# Altium schematic sheet 40.Flash-eMMC Flash.SchDoc
size 297 x 209 mm
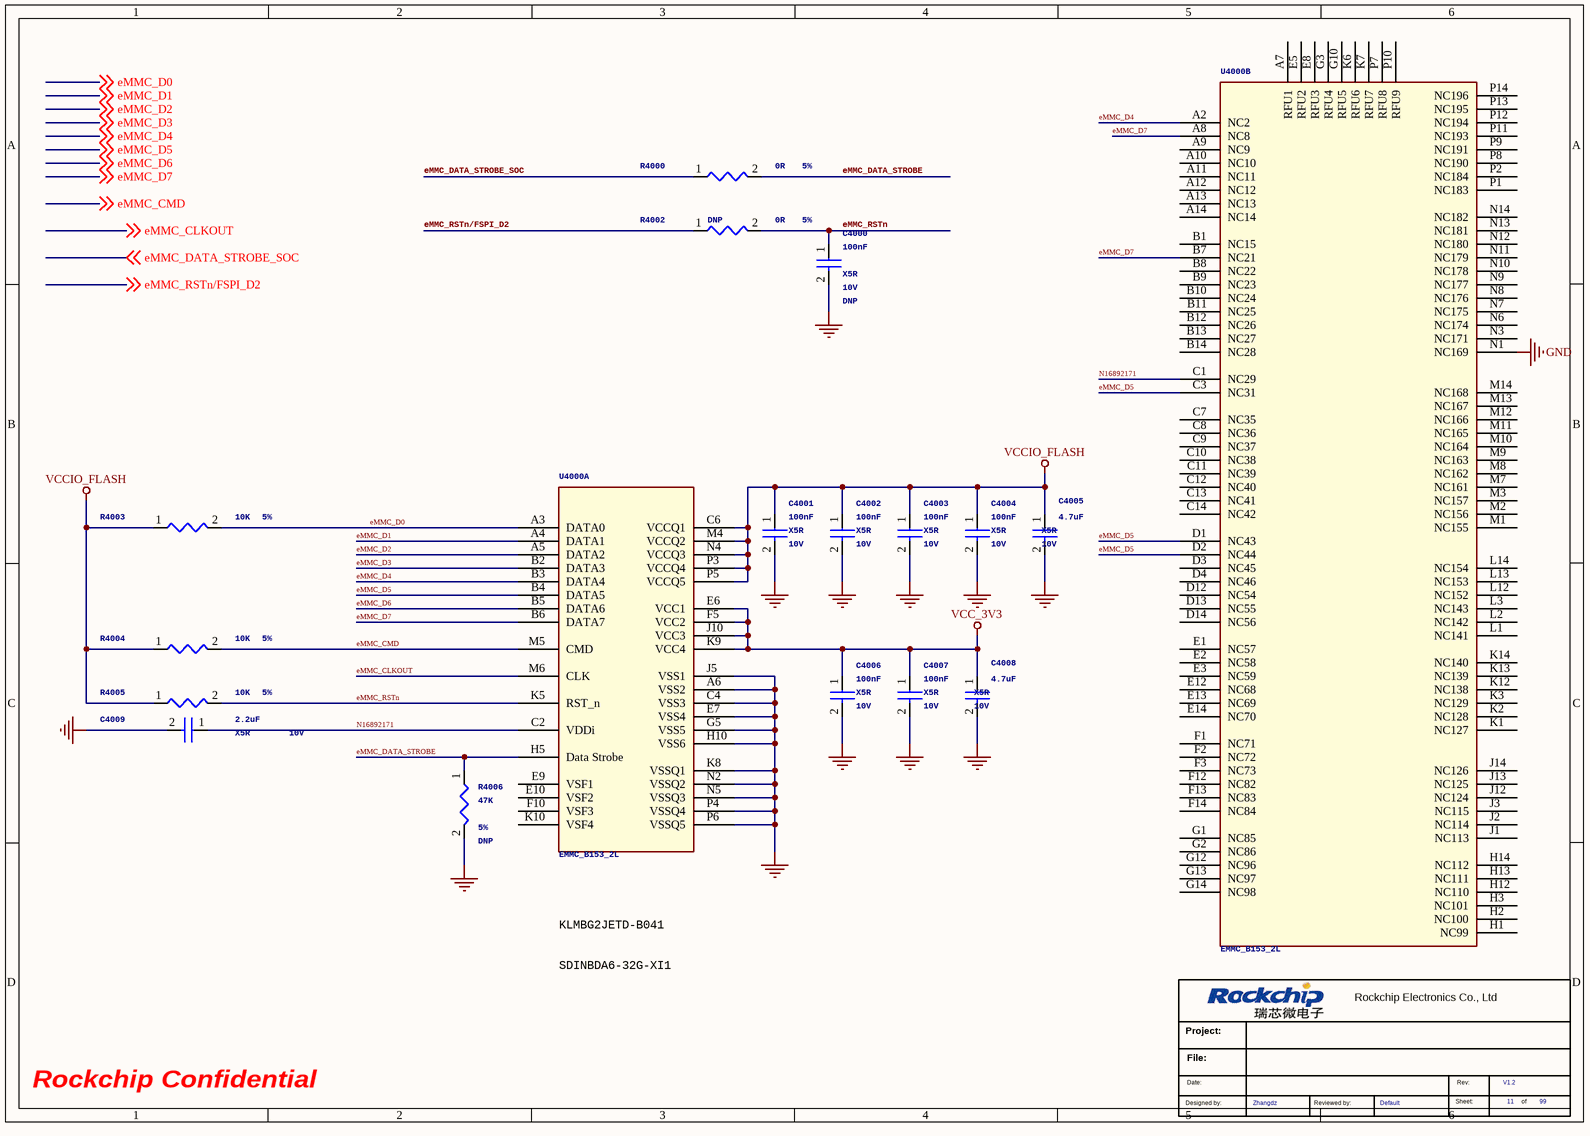
[diagram p0: 40.Flash-eMMC Flash.SchDoc]

## Parts
*  Schematic Page Count: 99  Schematic Page Number: 11  Designer: Zhangdz  Revision: V1.2  Check: Default  (hidden comment: Rockchip_new)  (graphical)
C4000  100nF  Voltage: 10V  Dielectric: X5R  option: DNP  [C0402]
C4001  100nF  Voltage: 10V  Dielectric: X5R  [C0402]
C4002  100nF  Voltage: 10V  Dielectric: X5R  [C0402]
C4003  100nF  Voltage: 10V  Dielectric: X5R  [C0402]
C4004  100nF  Voltage: 10V  Dielectric: X5R  [C0402]
C4005  4.7uF  Voltage: 10V  Dielectric: X5R  [C0603]
C4006  100nF  Voltage: 10V  Dielectric: X5R  [C0402]
C4007  100nF  Voltage: 10V  Dielectric: X5R  [C0402]
C4008  4.7uF  Voltage: 10V  Dielectric: X5R  [C0603]
C4009  2.2uF  Voltage: 10V  Dielectric: X5R  [C0402]
R4000  0R  Tolerance: 5%  [R0402]
R4002  0R  Tolerance: 5%  option: DNP  [R0402]
R4003  10K  Tolerance: 5%  [R0402]
R4004  10K  Tolerance: 5%  [R0402]
R4005  10K  Tolerance: 5%  [R0402]
R4006  47K  Tolerance: 5%  option: DNP  [R0402]
U4000  EMMC_B153_2L  [BGA153_13RX11R5X0R9_2L]  (parts A,B of 2)

## Nets
GND: C4000.2 C4001.2 C4002.2 C4003.2 C4004.2 C4005.2 C4006.2 C4007.2 C4008.2 C4009.2 R4006.2 U4000.A6(VSS2) U4000.C4(VSS3) U4000.E7(VSS4) U4000.G5(VSS5) U4000.H10(VSS6) U4000.J5(VSS1) U4000.K8(VSSQ1) U4000.N1(NC169) U4000.N2(VSSQ2) U4000.N5(VSSQ3) U4000.P4(VSSQ4) U4000.P6(VSSQ5)
VCC_3V3: C4006.1 C4007.1 C4008.1 U4000.E6(VCC1) U4000.F5(VCC2) U4000.J10(VCC3) U4000.K9(VCC4)
VCCIO_FLASH: C4001.1 C4002.1 C4003.1 C4004.1 C4005.1 R4003.1 R4004.1 R4005.1 U4000.C6(VCCQ1) U4000.M4(VCCQ2) U4000.N4(VCCQ3) U4000.P3(VCCQ4) U4000.P5(VCCQ5)
eMMC_CLKOUT: U4000.M6(CLK) ; off-sheet eMMC_CLKOUT
eMMC_CMD: R4004.2 U4000.M5(CMD) ; off-sheet eMMC_CMD
eMMC_D0: R4003.2 U4000.A3(DATA0) ; off-sheet eMMC_D0
eMMC_D1: U4000.A4(DATA1) ; off-sheet eMMC_D1
eMMC_D2: U4000.A5(DATA2) ; off-sheet eMMC_D2
eMMC_D3: U4000.B2(DATA3) ; off-sheet eMMC_D3
eMMC_D4: U4000.A2(NC2) U4000.B3(DATA4) ; off-sheet eMMC_D4
eMMC_D5: U4000.B4(DATA5) U4000.C3(NC31) U4000.D1(NC43) U4000.D2(NC44) ; off-sheet eMMC_D5
eMMC_D6: U4000.B5(DATA6) ; off-sheet eMMC_D6
eMMC_D7: U4000.A8(NC8) U4000.B6(DATA7) U4000.B7(NC21) ; off-sheet eMMC_D7
eMMC_DATA_STROBE: R4000.2 R4006.1 U4000.H5(Data_Strobe)
eMMC_DATA_STROBE_SOC: R4000.1 ; off-sheet eMMC_DATA_STROBE_SOC
eMMC_RSTn: C4000.1 R4002.2 R4005.2 U4000.K5(RST_n)
eMMC_RSTn/FSPI_D2: R4002.1 ; off-sheet eMMC_RSTn/FSPI_D2
N16892171: C4009.1 U4000.C1(NC29) U4000.C2(VDDi)

Not connected (* = marked no-connect by the designer): U4000 A7(RFU1) A9(NC9) A10(NC10) A11(NC11) A12(NC12) A13(NC13) A14(NC14) B1(NC15) B8(NC22) B9(NC23) B10(NC24) B11(NC25) B12(NC26) B13(NC27) B14(NC28) C7(NC35) C8(NC36) C9(NC37) C10(NC38) C11(NC39) C12(NC40) C13(NC41) C14(NC42) D3(NC45) D4(NC46) D12(NC54) D13(NC55) D14(NC56) E1(NC57) E2(NC58) E3(NC59) E5(RFU2) E8(RFU3) E9(VSF1) E10(VSF2) E12(NC68) E13(NC69) E14(NC70) F1(NC71) F2(NC72) F3(NC73) F10(VSF3) F12(NC82) F13(NC83) F14(NC84) G1(NC85) G2(NC86) G3(RFU4) G10(RFU5) G12(NC96) G13(NC97) G14(NC98) H1(NC99) H2(NC100) H3(NC101) H12(NC110) H13(NC111) H14(NC112) J1(NC113) J2(NC114) J3(NC115) J12(NC124) J13(NC125) J14(NC126) K1(NC127) K2(NC128) K3(NC129) K6(RFU6) K7(RFU7) K10(VSF4) K12(NC138) K13(NC139) K14(NC140) L1(NC141) L2(NC142) L3(NC143) L12(NC152) L13(NC153) L14(NC154) M1(NC155) M2(NC156) M3(NC157) M7(NC161) M8(NC162) M9(NC163) M10(NC164) M11(NC165) M12(NC166) M13(NC167) M14(NC168) N3(NC171) N6(NC174) N7(NC175) N8(NC176) N9(NC177) N10(NC178) N11(NC179) N12(NC180) N13(NC181) N14(NC182) P1(NC183) P2(NC184) P7(RFU8) P8(NC190) P9(NC191) P10(RFU9) P11(NC193) P12(NC194) P13(NC195) P14(NC196)

## Notes on the sheet
- KLMBG2JETD-B041
- SDINBDA6-32G-XI1
- Rockchip Confidential
- (in symbol Rockchip_new) Rockchip Electronics Co., Ltd; Project:; File:; Date:; Rev:; Designed by:; Reviewed by:; Sheet:; of

## Library data of the parts
* = Rockchip_new: Page Number: 23; Page Count: 37; Revcode: V1.2
C4000 C4002 C4003 C4006 C4007 = CAP NP: cap,100.00nF,+/-10%,10V,X5R,C0402; Manufacturer: TDK; RK PN: C1005X5R1A104K050BA; Priority: A; Tolerance: 10%; Part Type: C0402; Manufacturer PN: C1005X5R1A104K050BA; Created by: JJJ
C4001 C4004 = CAP NP: cap,100.00nF,+/-10%,10V,X5R,C0402; Manufacturer PN: C1005X5R1A104K050BA; Manufacturer: TDK; Tolerance: 10%; Priority: A; Created by: JJJ; Part Type: C0402; RK PN: C1005X5R1A104K050BA
C4005 C4008 = CAP NP: cap,4.70uF,+/-10%,10V,X5R,C0603; Manufacturer PN: C1608X5R1A475K080AC; Manufacturer: TDK; C_Voltage: 6.3V; Tolerance: 10%; Priority: A; Number: 37; Created by: JJJ; Part Type: C0603; RK PN: C1608X5R1A475K080AC
C4009 = CAP NP: cap,2.20uF,+/-10%,10V,X5R,C0402; Manufacturer: TDK; RK PN: C1005X5R1A225K050BC; Priority: A; Tolerance: 10%; Part Type: C0402; Manufacturer PN: C1005X5R1A225K050BC; Created by: JJJ
R4000 R4002 = RESISTOR: 通用厚膜电阻,0R,+/-5%,R0402,1/16W.; Manufacturer PN: RC0402JR-070RL; Manufacturer: YAGEO; Wattage: 1/16W; Priority: A; Created by: YTL; Part Type: 通用厚膜电阻; RK PN: RC0402JR-070RL
R4003-R4005 = RESISTOR: 通用厚膜电阻,10K,+/-5%,R0402,1/16W.; Manufacturer PN: RC0402JR-0710KL; Manufacturer: YAGEO; Wattage: 1/16W; Priority: A; Created by: YTL; Part Type: 通用厚膜电阻; RK PN: RC0402JR-0710KL
R4006 = RESISTOR: 通用厚膜电阻,47K,+/-5%,R0402,1/16W.; Manufacturer PN: RC0402JR-0747KL; Manufacturer: YAGEO; Wattage: 1/16W; Priority: A; Created by: YTL; Part Type: 通用厚膜电阻; RK PN: RC0402JR-0747KL
U4000 = INAND_EMMC_153_2L: EMMC_B153_2L,更好的满足工艺需求，Fanout方式部分走线跨接再球位上，挖除A1\C5球位; Priority: A; RK PN: EMMC_B153_2L; Part Type: NAND_FLASH; Created by: YWQ